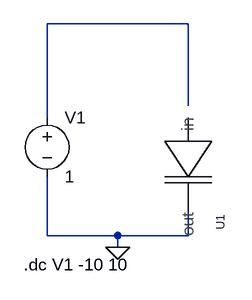
[diagram p0: schematic szembeforditott_varicap.asc]
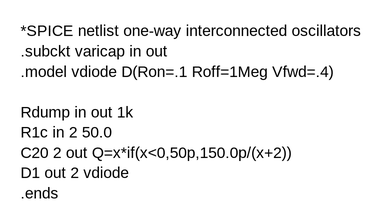
[diagram p1: sub-circuit varicap.asc]
szembeforditott_varicap.asc, the LTspice schematic file:
Version 4
SHEET 1 880 680
WIRE 480 304 288 304
WIRE 480 416 480 304
WIRE 288 432 288 304
WIRE 288 592 288 512
WIRE 384 592 288 592
WIRE 480 592 480 528
WIRE 480 592 384 592
WIRE 384 608 384 592
FLAG 384 608 0
SYMBOL AutoGenerated\\varicap 480 464 R90
SYMATTR InstName U1
SYMBOL voltage 288 416 R0
WINDOW 123 0 0 Left 0
WINDOW 39 0 0 Left 0
SYMATTR InstName V1
SYMATTR Value 1
TEXT 256 632 Left 2 !.dc V1 -10 10

varicap.asc, the sub-circuit schematic file:
Version 4
SHEET 1 1188 680
TEXT -24 72 Left 2 !*SPICE netlist one-way interconnected oscillators\n.subckt varicap in out\n.model vdiode D(Ron=.1 Roff=1Meg Vfwd=.4)\n \nRdump in out 1k \nR1c in 2 50.0\nC20 2 out Q=x*if(x<0,50p,150.0p/(x+2))\nD1 out 2 vdiode\n.ends

The netlist it stands for:
* szembeforditott_varicap.asc
XU1 varicap
V1 N001 0 1

* block symbol definitions
.subckt varicap 
*SPICE netlist one-way interconnected oscillators
.subckt varicap in out
.model vdiode D(Ron=.1 Roff=1Meg Vfwd=.4)
Rdump in out 1k
R1c in 2 50.0
C20 2 out Q=x*if(x<0,50p,150.0p/(x+2))
D1 out 2 vdiode
.ends
.ends varicap

.dc V1 -10 10
.backanno
.end